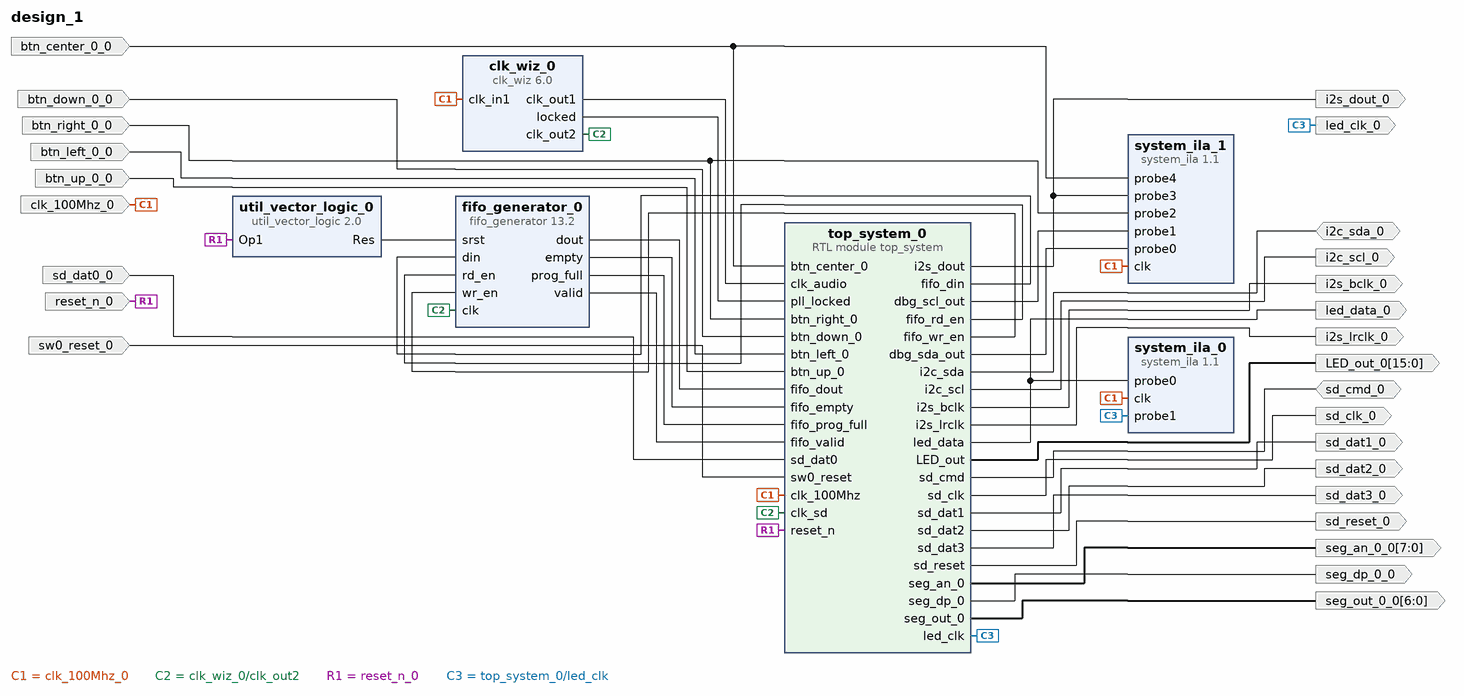
[diagram p0: block diagram of the top level]
# Vivado block design design_1, xc7a100tcsg324-1, Vivado 2025.1
create_bd_design design_1

create_bd_port -dir I clk_100Mhz_0
create_bd_port -dir I -type rst reset_n_0
create_bd_port -dir O -type clk led_clk_0
create_bd_port -dir O led_data_0
create_bd_port -dir O -from 6 -to 0 seg_out_0_0
create_bd_port -dir O -from 7 -to 0 seg_an_0_0
create_bd_port -dir O seg_dp_0_0
create_bd_port -dir I btn_up_0_0
create_bd_port -dir I btn_down_0_0
create_bd_port -dir I btn_left_0_0
create_bd_port -dir I btn_right_0_0
create_bd_port -dir IO i2c_sda_0
create_bd_port -dir I btn_center_0_0
create_bd_port -dir O i2s_bclk_0
create_bd_port -dir O i2s_lrclk_0
create_bd_port -dir O i2s_dout_0
create_bd_port -dir O i2c_scl_0
create_bd_port -dir O sd_dat3_0
create_bd_port -dir O sd_dat2_0
create_bd_port -dir IO sd_cmd_0
create_bd_port -dir O -type clk sd_clk_0
create_bd_port -dir O sd_dat1_0
create_bd_port -dir I sd_dat0_0
create_bd_port -dir O -from 15 -to 0 LED_out_0
create_bd_port -dir I -type rst sw0_reset_0
create_bd_port -dir O -type rst sd_reset_0

create_bd_cell -type module -reference top_system top_system_0
create_bd_cell -type ip -vlnv xilinx.com:ip:system_ila:1.1 system_ila_0
set_property -dict [list \
  CONFIG.C_DATA_DEPTH 4096 \
  CONFIG.C_MON_TYPE NATIVE \
  CONFIG.C_NUM_OF_PROBES 2 \
  CONFIG.C_PROBE0_TYPE 0 \
] [get_bd_cells system_ila_0]
create_bd_cell -type ip -vlnv xilinx.com:ip:system_ila:1.1 system_ila_1
set_property -dict [list \
  CONFIG.C_DATA_DEPTH 65536 \
  CONFIG.C_MON_TYPE NATIVE \
  CONFIG.C_NUM_OF_PROBES 5 \
  CONFIG.C_PROBE0_TYPE 0 \
  CONFIG.C_PROBE1_TYPE 0 \
] [get_bd_cells system_ila_1]
create_bd_cell -type ip -vlnv xilinx.com:ip:clk_wiz:6.0 clk_wiz_0
set_property -dict [list \
  CONFIG.CLKOUT1_JITTER 201.426 \
  CONFIG.CLKOUT1_PHASE_ERROR 98.575 \
  CONFIG.CLKOUT1_REQUESTED_OUT_FREQ 12.288 \
  CONFIG.CLKOUT2_JITTER 151.636 \
  CONFIG.CLKOUT2_PHASE_ERROR 98.575 \
  CONFIG.CLKOUT2_REQUESTED_OUT_FREQ 50 \
  CONFIG.CLKOUT2_USED true \
  CONFIG.MMCM_CLKFBOUT_MULT_F 10.000 \
  CONFIG.MMCM_CLKOUT0_DIVIDE_F 81.375 \
  CONFIG.MMCM_CLKOUT1_DIVIDE 20 \
  CONFIG.MMCM_DIVCLK_DIVIDE 1 \
  CONFIG.NUM_OUT_CLKS 2 \
  CONFIG.USE_LOCKED true \
  CONFIG.USE_RESET false \
] [get_bd_cells clk_wiz_0]
create_bd_cell -type ip -vlnv xilinx.com:ip:fifo_generator:13.2 fifo_generator_0
set_property -dict [list \
  CONFIG.Full_Threshold_Assert_Value 15000 \
  CONFIG.Input_Data_Width 8 \
  CONFIG.Input_Depth 16384 \
  CONFIG.Programmable_Full_Type Single_Programmable_Full_Threshold_Constant \
  CONFIG.Valid_Flag true \
] [get_bd_cells fifo_generator_0]
create_bd_cell -type ip -vlnv xilinx.com:ip:util_vector_logic:2.0 util_vector_logic_0
set_property -dict {CONFIG.C_OPERATION not} [get_bd_cells util_vector_logic_0]

# ---- connections ----

connect_bd_net [get_bd_ports i2c_sda_0] [get_bd_pins top_system_0/i2c_sda]
connect_bd_net [get_bd_ports sd_cmd_0] [get_bd_pins top_system_0/sd_cmd]
connect_bd_net -net btn_center_0_0_1 [get_bd_ports btn_center_0_0] [get_bd_pins system_ila_1/probe4] [get_bd_pins top_system_0/btn_center_0]
connect_bd_net -net btn_down_0_0_1 [get_bd_ports btn_down_0_0] [get_bd_pins top_system_0/btn_down_0]
connect_bd_net -net btn_left_0_0_1 [get_bd_ports btn_left_0_0] [get_bd_pins top_system_0/btn_left_0]
connect_bd_net -net btn_right_0_0_1 [get_bd_ports btn_right_0_0] [get_bd_pins system_ila_1/probe2] [get_bd_pins top_system_0/btn_right_0]
connect_bd_net -net btn_up_0_0_1 [get_bd_ports btn_up_0_0] [get_bd_pins top_system_0/btn_up_0]
connect_bd_net -net clk_100Mhz_0_1 [get_bd_ports clk_100Mhz_0] \
  [get_bd_pins clk_wiz_0/clk_in1] [get_bd_pins system_ila_1/clk] [get_bd_pins system_ila_0/clk] \
  [get_bd_pins top_system_0/clk_100Mhz]
connect_bd_net [get_bd_pins clk_wiz_0/clk_out1] [get_bd_pins top_system_0/clk_audio]
connect_bd_net [get_bd_pins clk_wiz_0/clk_out2] [get_bd_pins fifo_generator_0/clk] [get_bd_pins top_system_0/clk_sd]
connect_bd_net [get_bd_pins clk_wiz_0/locked] [get_bd_pins top_system_0/pll_locked]
connect_bd_net [get_bd_pins fifo_generator_0/dout] [get_bd_pins top_system_0/fifo_dout]
connect_bd_net [get_bd_pins fifo_generator_0/empty] [get_bd_pins top_system_0/fifo_empty]
connect_bd_net [get_bd_pins fifo_generator_0/prog_full] [get_bd_pins top_system_0/fifo_prog_full]
connect_bd_net [get_bd_pins fifo_generator_0/valid] [get_bd_pins top_system_0/fifo_valid]
connect_bd_net -net reset_n_0_1 [get_bd_ports reset_n_0] [get_bd_pins util_vector_logic_0/Op1] [get_bd_pins top_system_0/reset_n]
connect_bd_net -net sd_dat0_0_1 [get_bd_ports sd_dat0_0] [get_bd_pins top_system_0/sd_dat0]
connect_bd_net -net sw0_reset_0_1 [get_bd_ports sw0_reset_0] [get_bd_pins top_system_0/sw0_reset]
connect_bd_net [get_bd_pins top_system_0/LED_out] [get_bd_ports LED_out_0]
connect_bd_net -net top_system_0_dbg_scl_out [get_bd_pins top_system_0/dbg_scl_out] [get_bd_pins system_ila_1/probe1]
connect_bd_net -net top_system_0_dbg_sda_out [get_bd_pins top_system_0/dbg_sda_out] [get_bd_pins system_ila_1/probe0]
connect_bd_net [get_bd_pins top_system_0/fifo_din] [get_bd_pins fifo_generator_0/din]
connect_bd_net [get_bd_pins top_system_0/fifo_rd_en] [get_bd_pins fifo_generator_0/rd_en]
connect_bd_net [get_bd_pins top_system_0/fifo_wr_en] [get_bd_pins fifo_generator_0/wr_en]
connect_bd_net [get_bd_pins top_system_0/i2c_scl] [get_bd_ports i2c_scl_0]
connect_bd_net [get_bd_pins top_system_0/i2s_bclk] [get_bd_ports i2s_bclk_0]
connect_bd_net -net top_system_0_i2s_dout [get_bd_pins top_system_0/i2s_dout] [get_bd_ports i2s_dout_0] [get_bd_pins system_ila_1/probe3]
connect_bd_net [get_bd_pins top_system_0/i2s_lrclk] [get_bd_ports i2s_lrclk_0]
connect_bd_net [get_bd_pins top_system_0/led_clk] [get_bd_ports led_clk_0] [get_bd_pins system_ila_0/probe1]
connect_bd_net -net top_system_0_led_data [get_bd_pins top_system_0/led_data] [get_bd_ports led_data_0] [get_bd_pins system_ila_0/probe0]
connect_bd_net [get_bd_pins top_system_0/sd_clk] [get_bd_ports sd_clk_0]
connect_bd_net [get_bd_pins top_system_0/sd_dat1] [get_bd_ports sd_dat1_0]
connect_bd_net [get_bd_pins top_system_0/sd_dat2] [get_bd_ports sd_dat2_0]
connect_bd_net [get_bd_pins top_system_0/sd_dat3] [get_bd_ports sd_dat3_0]
connect_bd_net [get_bd_pins top_system_0/sd_reset] [get_bd_ports sd_reset_0]
connect_bd_net [get_bd_pins top_system_0/seg_an_0] [get_bd_ports seg_an_0_0]
connect_bd_net [get_bd_pins top_system_0/seg_dp_0] [get_bd_ports seg_dp_0_0]
connect_bd_net [get_bd_pins top_system_0/seg_out_0] [get_bd_ports seg_out_0_0]
connect_bd_net [get_bd_pins util_vector_logic_0/Res] [get_bd_pins fifo_generator_0/srst]
set_property HDL_ATTRIBUTE.DEBUG true [get_bd_nets btn_center_0_0_1]
set_property HDL_ATTRIBUTE.MARK_DEBUG true [get_bd_nets btn_center_0_0_1]
set_property HDL_ATTRIBUTE.DEBUG true [get_bd_nets top_system_0_dbg_scl_out]
set_property HDL_ATTRIBUTE.MARK_DEBUG true [get_bd_nets top_system_0_dbg_scl_out]
set_property HDL_ATTRIBUTE.DEBUG true [get_bd_nets top_system_0_dbg_sda_out]
set_property HDL_ATTRIBUTE.MARK_DEBUG true [get_bd_nets top_system_0_dbg_sda_out]
set_property HDL_ATTRIBUTE.DEBUG true [get_bd_nets top_system_0_i2s_dout]
set_property HDL_ATTRIBUTE.MARK_DEBUG true [get_bd_nets top_system_0_i2s_dout]
set_property HDL_ATTRIBUTE.DEBUG true [get_bd_nets top_system_0_led_data]
set_property HDL_ATTRIBUTE.MARK_DEBUG true [get_bd_nets top_system_0_led_data]

validate_bd_design
save_bd_design
